# EAGLE design H0FR71 (EAGLE 9.6.2)

## Sheet 1 of 2
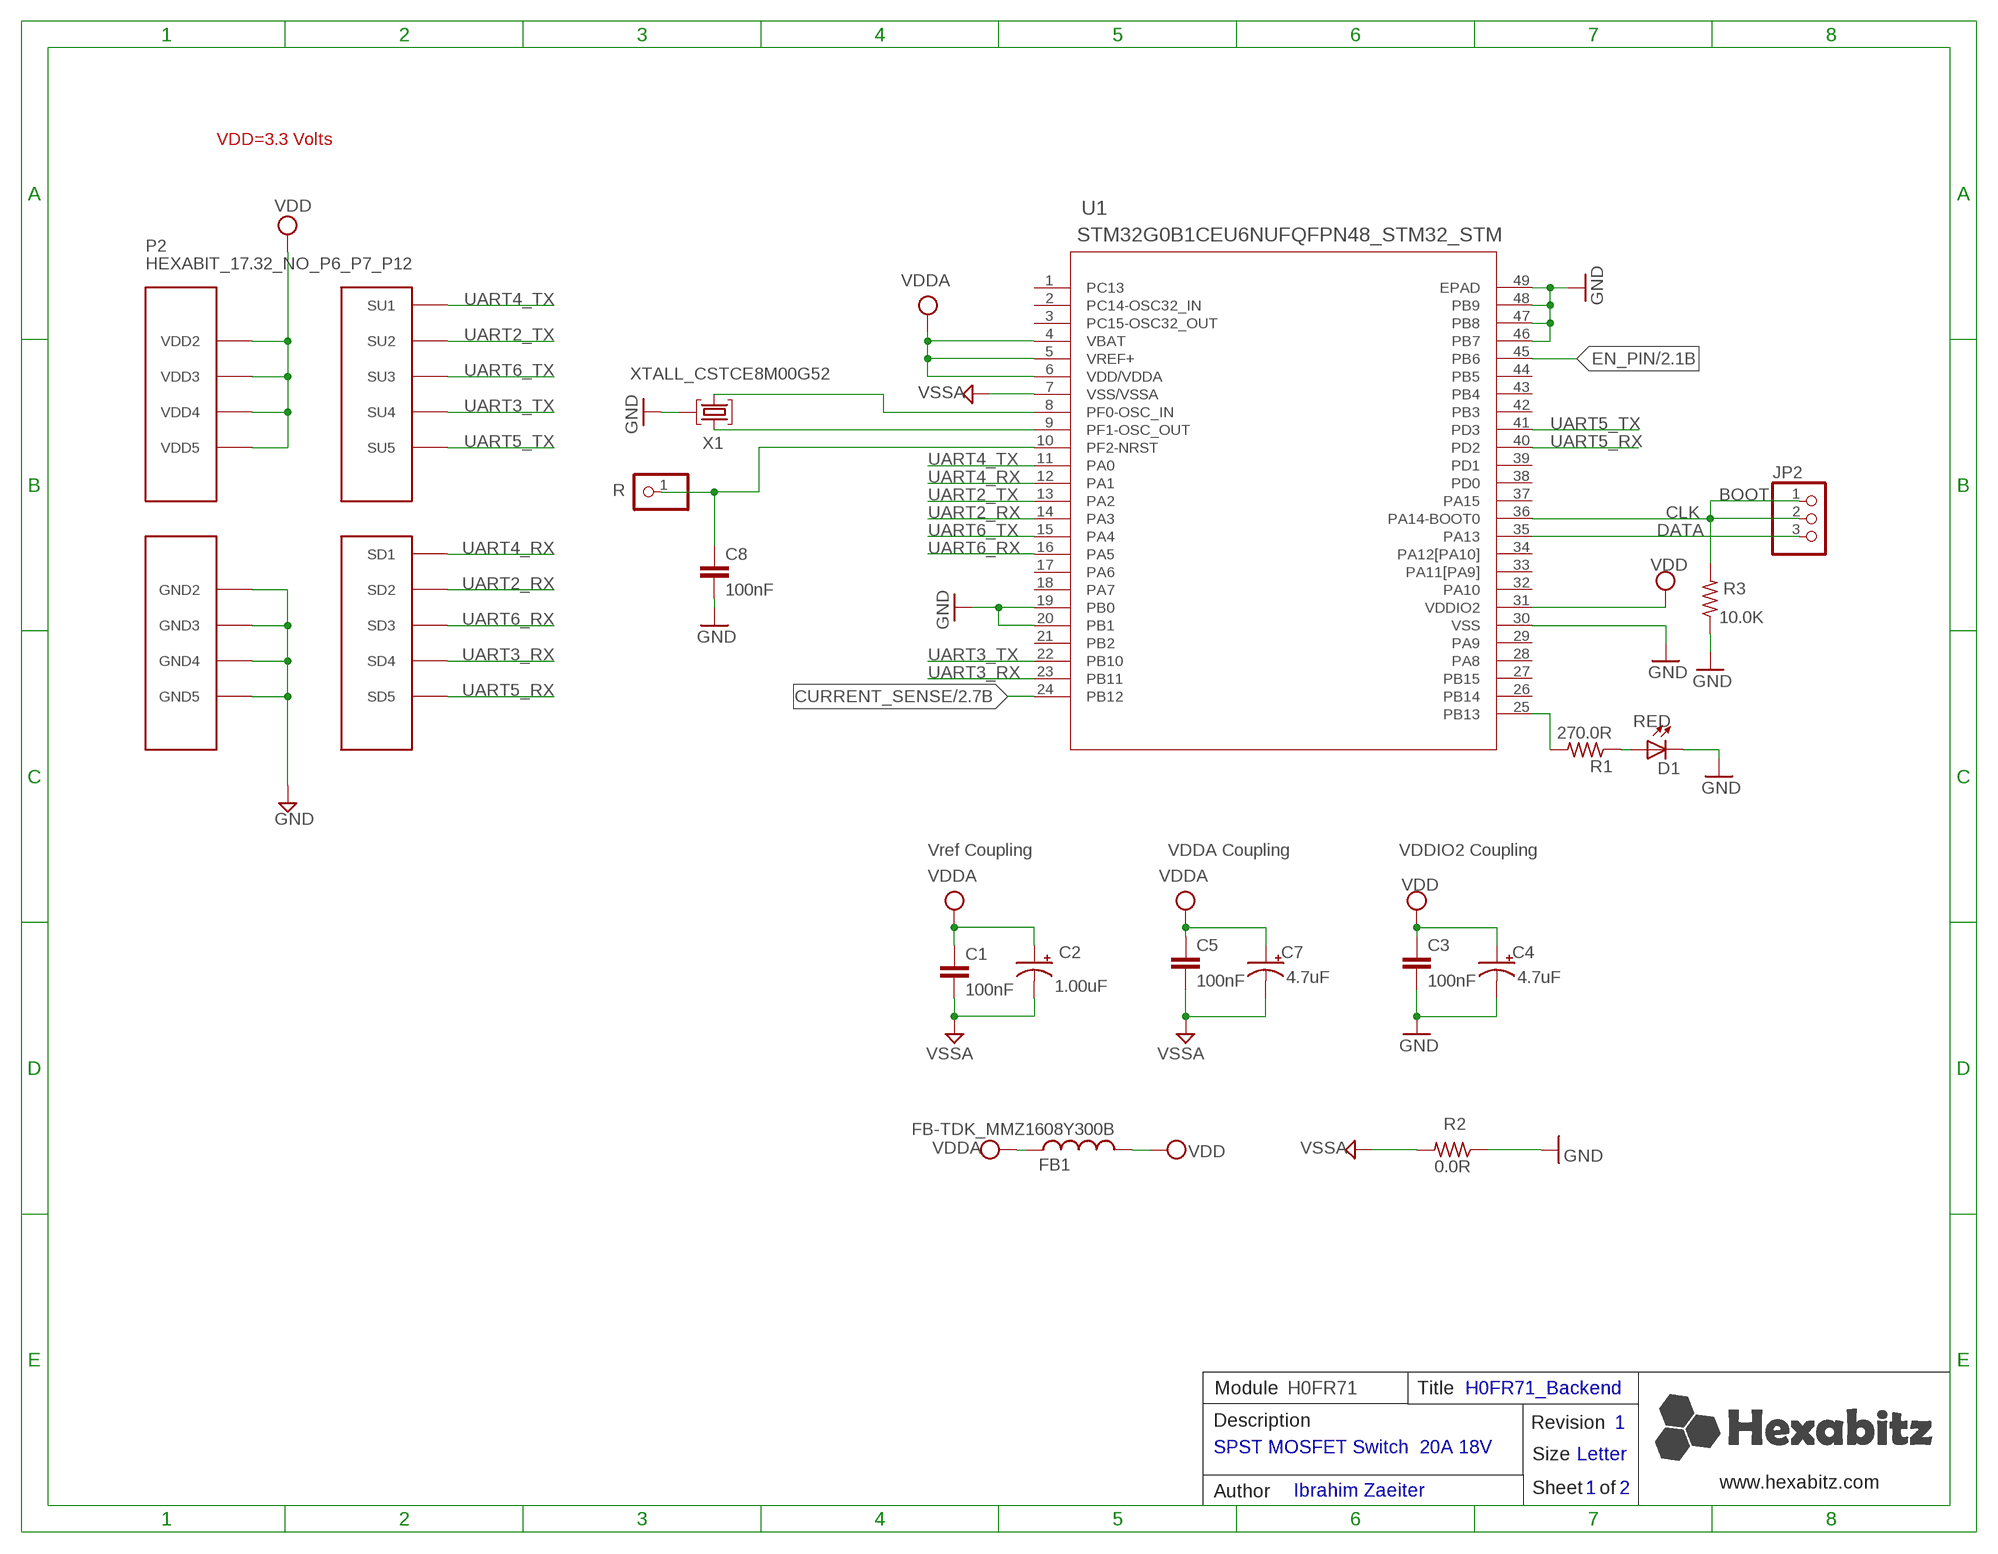
[diagram p0: schematic, sheet 1]

### Parts
C1  100nF  C-0603  [C-0603]
C2  1.00uF  C-0805-POL  [C-0805-POL]
C3  100nF  C-0603  [C-0603]
C4  4.7uF  C-0805-POL  [C-0805-POL]
C5  100nF  C-0603  [C-0603]
C7  4.7uF  C-0805-POL  [C-0805-POL]
C8  100nF  C-0603  [C-0603]
D1  RED  VLMS1300-GS08  [VLMS1300-GS08]
FB1  FB-TDK_MMZ1608Y300B  [FB-TDK_MMZ1608Y300B]
JP2  PINHD-1X3  [1X03]
P2  HEXABIT_17.32_NO_P6_P7_P12  [HEXABIT_17.32_NO_P6_P7_P12]
R  PINHD-1X1  [1X01]
R1  270.0R  R-0603  [R-0603]
R2  0.0R  R-0603  [R-0603]
R3  10.0K  R-0603  [R-0603]
U1  STM32G0B1CEU6NUFQFPN48_STM32_STM  [UFQFPN48_STM32_STM]
X1  XTALL_CSTCE8M00G52  [XTALL_CSTCE8M00G52]

### Nets
AGND: C1.2 C2.2(-) C5.2 C7.2(-) R2.2 U1.7(VSS/VSSA) ; supply symbol labelled VSSA ; also sheet 2
CLK: JP2.1 JP2.2 R3.2 U1.36(PA14-BOOT0)
CURRENT_SENSE: U1.24(PB12) ; also sheet 2
DATA: JP2.3 U1.35(PA13)
EN_PIN: U1.45(PB6) ; also sheet 2
GND: C3.2 C4.2(-) C8.2 D1.C P2.PAD_PD8(GND2) P2.PAD_PD9(GND3) P2.PAD_PD10(GND4) P2.PAD_PD11(GND5) R2.1 R3.1 U1.19(PB0) U1.20(PB1) U1.30(VSS) U1.46(PB7) U1.47(PB8) U1.48(PB9) U1.49(EPAD) X1.P$2 ; also sheet 2
N$1: U1.9(PF1-OSC_OUT) X1.P$3
N$2: U1.8(PF0-OSC_IN) X1.P$1
N$3: R1.2 U1.25(PB13)
N$4: D1.A R1.1
N$5: C8.1 R.1 U1.10(PF2-NRST)
UART2_RX: P2.PAD_PD2(SD2) U1.14(PA3)
UART2_TX: P2.PAD_PU2(SU2) U1.13(PA2)
UART3_RX: P2.PAD_PD4(SD4) U1.23(PB11)
UART3_TX: P2.PAD_PU4(SU4) U1.22(PB10)
UART4_RX: P2.PAD_PD1(SD1) U1.12(PA1)
UART4_TX: P2.PAD_PU1(SU1) U1.11(PA0)
UART5_RX: P2.PAD_PD5(SD5) U1.40(PD2)
UART5_TX: P2.PAD_PU5(SU5) U1.41(PD3)
UART6_RX: P2.PAD_PD3(SD3) U1.16(PA5)
UART6_TX: P2.PAD_PU3(SU3) U1.15(PA4)
VDD: C3.1 C4.1(+) FB1.2 P2.PAD_PU8(VDD2) P2.PAD_PU9(VDD3) P2.PAD_PU10(VDD4) P2.PAD_PU11(VDD5) U1.31(VDDIO2)
VDDA: C1.1 C2.1(+) C5.1 C7.1(+) FB1.1 U1.4(VBAT) U1.5(VREF+) U1.6(VDD/VDDA) ; also sheet 2
Unconnected: U1.1(PC13) U1.2(PC14-OSC32_IN) U1.3(PC15-OSC32_OUT) U1.17(PA6) U1.18(PA7) U1.21(PB2) U1.26(PB14) U1.27(PB15) U1.28(PA8) U1.29(PA9) U1.32(PA10) U1.33(PA11[PA9]) U1.34(PA12[PA10]) U1.37(PA15) U1.38(PD0) U1.39(PD1) U1.42(PB3) U1.43(PB4) U1.44(PB5)

### Notes on the sheet
- VDD=3.3 Volts
- BOOT
- Vref Coupling | VDDA Coupling | VDDIO2 Coupling
- Module | H0FR71 | Title | H0FR71_Backend
- Description | Revision | 1
- SPST MOSFET Switch  20A 18V
- Size | Letter
- www.hexabitz.com
- Author | Ibrahim Zaeiter | Sheet   of | 1 | 2
- C:/Users/Admin/Desktop/logodraft.bmp

## Sheet 2 of 2
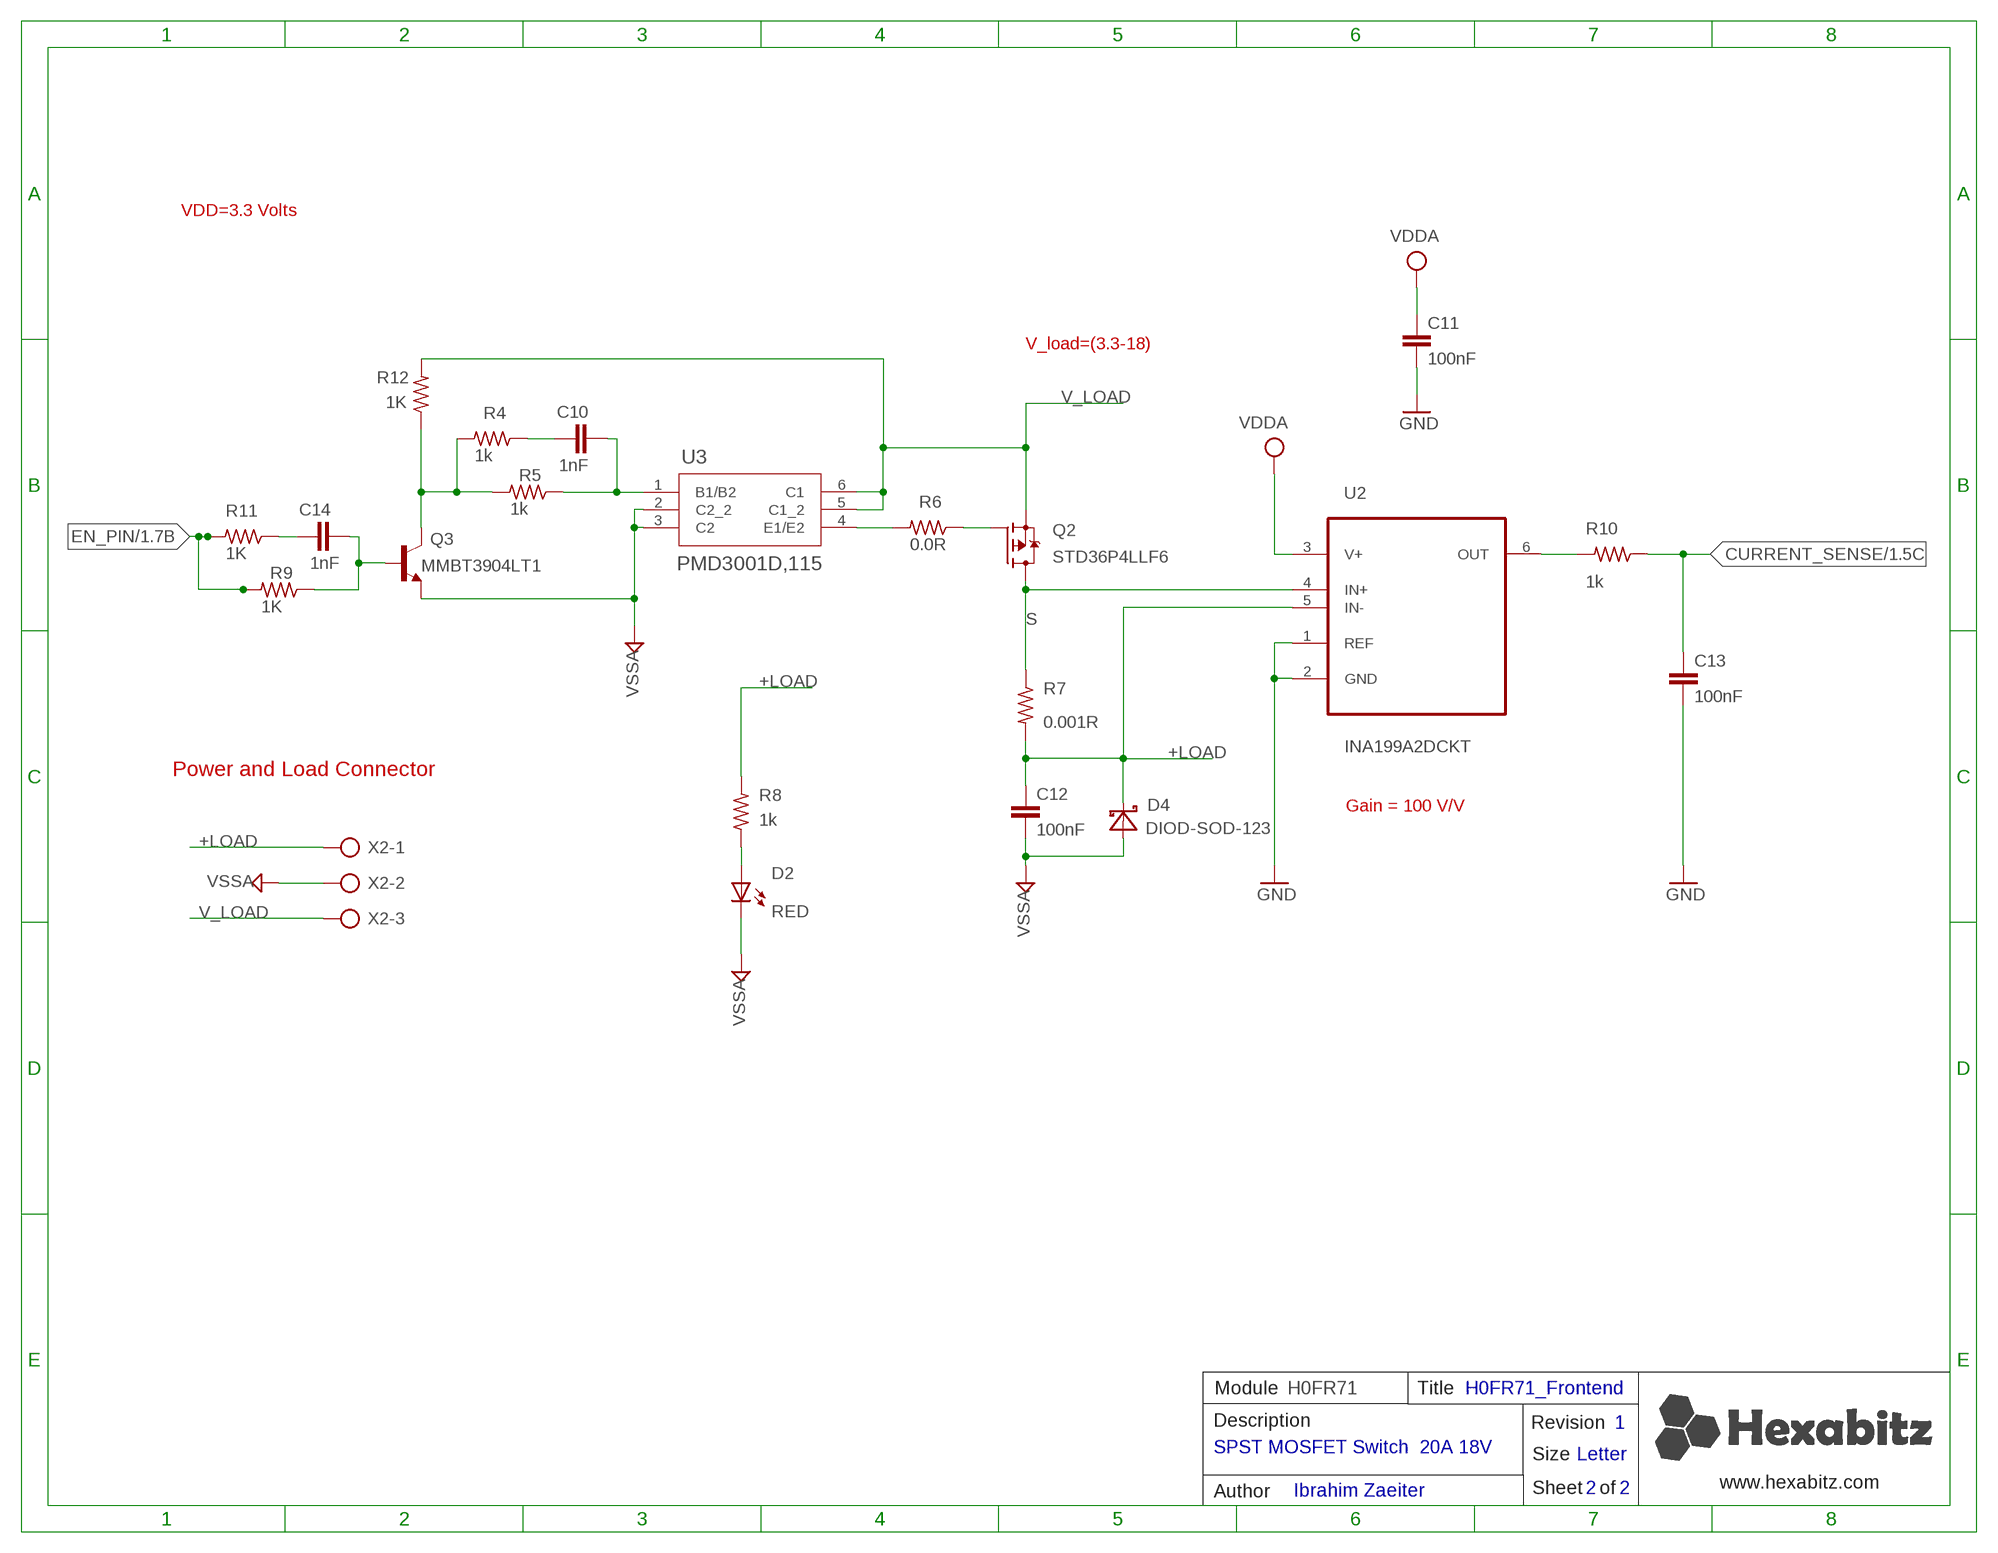
[diagram p1: schematic, sheet 2]

### Parts
C10  1nF  C-0603  [C-0603]
C11  100nF  C-0603  [C-0603]
C12  100nF  C-0603  [C-0603]
C13  100nF  C-0603  [C-0603]
C14  1nF  C-0603  [C-0603]
D2  RED  VLMS1300-GS08  [VLMS1300-GS08]
D4  DIOD-SOD-123  [SOD123]
Q2  STD36P4LLF6  [DPAK-3]
Q3  MMBT3904LT1  [MMBT3904LT1]
R4  1k  R-0603  [R-0603]
R5  1k  R-0603  [R-0603]
R6  0.0R  R-0603  [R-0603]
R7  0.001R  R-US_R2512  [R2512]
R8  1k  R-0603  [R-0603]
R9  1K  R-0603  [R-0603]
R10  1k  R-0603  [R-0603]
R11  1K  R-0603  [R-0603]
R12  1K  R-0603  [R-0603]
U2  INA199A2DCKT  [SOT65P210X110-6N]
U3  PMD3001D,115  PMD3001DSOT457_NEX  [SOT457_NEX]
X2  AK500/3  [AK500/3]

### Nets
+LOAD: C12.1 D4.2(C) R7.2 R8.2 U2.5(IN-) X2.1
AGND: C12.2 D2.C D4.1(A) Q3.2(E) U3.2(C2_2) U3.3(C2) X2.2 ; supply symbol labelled VSSA ; also sheet 1
CURRENT_SENSE: C13.1 R10.1 ; also sheet 1
EN_PIN: R9.2 R11.2 ; also sheet 1
GND: C11.2 C13.2 U2.1(REF) U2.2(GND) ; also sheet 1
N$7: C10.2 R5.1 U3.1(B1/B2)
N$8: D2.A R8.1
N$9: R10.2 U2.6(OUT)
N$10: Q2.1(G) R6.1
N$11: Q3.3(C) R4.2 R5.2 R12.1
N$12: R6.2 U3.4(E1/E2)
N$13: C10.1 R4.1
N$14: C14.2 Q3.1(B) R9.1
N$15: C14.1 R11.1
S: Q2.4(D) R7.1 U2.4(IN+)
V_LOAD: Q2.3(S) R12.2 U3.5(C1_2) U3.6(C1) X2.3
VDDA: C11.1 U2.3(V+) ; also sheet 1

### Notes on the sheet
- VDD=3.3 Volts
- V_load=(3.3-18)
- Power and Load Connector
- Gain = 100 V/V
- Module | H0FR71 | Title | H0FR71_Frontend
- Description | Revision | 1
- SPST MOSFET Switch  20A 18V
- Size | Letter
- www.hexabitz.com
- Author | Ibrahim Zaeiter | Sheet   of | 2 | 2

## Library data of the parts
C1 C3 C8 C10 C12-C14 = HEXABITZ_RCLS:C-0603: CAP CER 10% X7R 0603; CAPACITANCE: 100nF; MFN: KEMET; MPN: C0603C104K8RACTU; OCTOPART_URL: https://octopart.com/c0603c104k8ractu-kemet-145075?r=sp&s=9bS9ASSwSEqMCE9KBEQZ0g; TOLERANCE: 10%; VOLTAGE_RATING: 10V
C2 = HEXABITZ_RCLS:C-0805-POL: Cap Tant Solid SMD 2012; CAPACITANCE: 1.00uF; MFN: Yageo; MPN: CC0805KKX7R7BB105; OCTOPART_URL: https://octopart.com/cc0805kkx7r7bb105-yageo-8376555?r=sp&s=YKl1wwtkROau_X5nniH2ig; TOLERANCE: 10%; VOLTAGE_RATING: 16V
C4 C7 = HEXABITZ_RCLS:C-0805-POL: Cap Tant Solid SMD 2012; CAPACITANCE: 4.7uF; MFN: Murata; MPN: GRM21BC81E475KA12L; OCTOPART_URL: https://octopart.com/grm21bc81e475ka12l-murata-10331911?r=sp&s=RY3qZSD8T6mG6TC9CHI5qQ; TOLERANCE: 10%; VOLTAGE_RATING: 25V
C5 = HEXABITZ_RCLS:C-0603: CAP CER 10% X7R 0603; CAPACITANCE: 100nF; MFN: KEMET; MPN: C0603C104K8RACTU; OCTOPART_URL: https://octopart.com/c0603c104k8ractu-kemet-145075?r=sp&s=9bS9ASSwSEqMCE9KBEQZ0g; TOLERANCE: 10%; VOLTAGE_RATING: 10
C11 = HEXABITZ_RCLS:C-0603: CAP CER 10% X7R 0603; CAPACITANCE: 100nF; MFN: KEMET; MPN: C0603C104K8RACTU; OCTOPART_URL: https://octopart.com/c0603c104k8ractu-kemet-145075?r=sp&s=9bS9ASSwSEqMCE9KBEQZ0g; TOLERANCE: 10V; VOLTAGE_RATING: 10%
D1 = HEXABITZ_USER_INTERFACE_PARTS:VLMS1300-GS08: Red 0603 130° Clear 54 mcd 2 V Surface Mount ChipLED ; Octopart Url : http://octopart.com/vlms1300-gs08-vishay-21709201; MFN: Vishay; MPN: VLMS1300-GS08; OCTOPART_URL: https://octopart.com/vlms1300-gs08-vishay-21709201?r=sp&s=_gcP4_q8T1SC6PJQPTQ9yA
D2 = HEXABITZ_USER_INTERFACE_PARTS:VLMS1300-GS08: Red 0603 130° Clear 54 mcd 2 V Surface Mount ChipLED ; Octopart Url : http://octopart.com/vlms1300-gs08-vishay-21709201; MFN: Vishay; MPN: VLMO1300-GS08; OCTOPART_URL: https://octopart.com/vlmo1300-gs08-vishay-21709200?r=sp#
D4 = HEXABITZ_RCLS:DIOD-SOD-123: 1.0 A Surface Mount Schottky Barrier Rectifier, 40 V, -65 to 125 degC, 2-Pin SOD-123 Package, RoHS, Tape and Reel
FB1 = HEXABITZ_RCLS:FB-TDK_MMZ1608Y300B: Ferrite Beads Multi-Layer 30Ohm 25% 100MHz 1.5A 50mOhm DCR 0603; MFN: TDK; MPN: MMZ1608Y300B; OCTOPART_URL: https://octopart.com/mmz1608y300b-tdk-368280?r=sp&s=cd9_2ZEqQ9q9UNBuQgHAiA
JP2 = pinhead:PINHD-1X3: PIN HEADER
P2 = hexabitz_connectors:HEXABIT_?_NO_P6_P7_P12: Hexabitz Hexagon Module Connector Hexagon side length = 17.32mm. The following ports are removed: P6 P7 P12
Q2 = HEXABITZ_RCLS:STD36P4LLF6: P-channel 40 V, 0.0175 Ω typ.,36 A, STripFET™ F6 Power MOSFET in a DPAK package; DISCRIPTION: P-channel 40 V, 0.0175 Ohm typ., 36 A STripFET F6 in a DPAK package; MFN: STMicroelectronics; MPN: STD36P4LLF6; OCTOPART_URL: https://octopart.com/std36p4llf6-stmicroelectronics-34425371?r=sp
Q3 = HEXABITZ_RCLS:MMBT3904LT1: TRANS NPN 40V 0.2A SOT23; MOUNTING_STYLE: Surface Mount; NUM_OF_PINS: 3; PACKAGE: SOT-23-3; PACKAGING: Reel; PRODUCT_CATEGORY: Transistors Bipolar-BJT; SERIES: MMBT3904L
R = HEXABITZ_USER_INTERFACE_PARTS:PINHD-1X1: PIN HEADER; MFN: TE Connectivity; MPN: 87227-1; OCTOPART_URL: https://octopart.com/87227-1-te+connectivity-39512052?r=sp
R1 = HEXABITZ_RCLS:R-0603: Thick Film Resistors - SMD 0603; MFN: Yageo; MPN: RC0603FR-07270RL; OCTOPART_URL: https://octopart.com/search?q=RC0603FR-07270RL&start=0; RESISTANCE: 270.0 Ohm; TOLERANCE: 1%
R2 R6 = HEXABITZ_RCLS:R-0603: Thick Film Resistors - SMD 0603; MFN: Yageo; MPN: RC0603JR-070RL; OCTOPART_URL: https://octopart.com/rc0603jr-070rl-yageo-1241539?r=sp&s=X2NteqRjRNWrnx42Y0aliA; RESISTANCE: 0.0 Ohm
R3 R12 = HEXABITZ_RCLS:R-0603: Thick Film Resistors - SMD 0603; MFN: Yageo; MPN: RC0603JR-0710KL; OCTOPART_URL: https://octopart.com/search?q=RC0603JR-0710KL&start=0; RESISTANCE: 10.0K Ohm; TOLERANCE: 5%
R4 R5 R9 R11 = HEXABITZ_RCLS:R-0603: Thick Film Resistors - SMD 0603; MFN: Yageo; MPN: RC0603JR-07680KL; OCTOPART_URL: https://octopart.com/rc0603jr-07680kl-yageo-40953169?r=sp; RESISTANCE: 680K Ohm; TOLERANCE: 5%
R7 = HEXABITZ_RCLS:R-US_: RESISTOR, American symbol; SPICEPREFIX: R
R8 = HEXABITZ_RCLS:R-0603: Thick Film Resistors - SMD 0603; MFN: Yageo; MPN: RC0603JR-071KL; OCTOPART_URL: https://octopart.com/rc0603jr-071kl-yageo-55402888?r=sp; RESISTANCE: 1k; TOLERANCE: 1%
R10 = HEXABITZ_RCLS:R-0603: Thick Film Resistors - SMD 0603; MFN: Yageo; MPN: RC0603JR-071KL; OCTOPART_URL: https://octopart.com/rc0603jr-071kl-yageo-55402888?r=sp; RESISTANCE: 1k; TOLERANCE: 5%
U1 = HEXABITZ_ICs:STM32G0B1CEU6N; COPYRIGHT: Copyright (C) 2022 Ultra Librarian. All rights reserved.; MFN: STMicroelectronics; MPN: STM32G0B1CEU6N; OCTOPART_URL: https://app.ultralibrarian.com/details/c038d58b-752a-11eb-9033-0a34d6323d74/STMicroelectronics/STM32G0B1CEU6N?uid=116364672
U2 = HEXABITZ_ICs:INA199A2DCKT: CURRENT SHUNT MONITOR; DESCRIPTION: 26V, bi-directional current sense amplifier 6-SC70 -40 to 125; MFN: Texas Instruments; MPN: INA199A2DCKT; OCTOPART_URL: https://octopart.com/ina199a2dckt-texas+instruments-18607270?r=sp
U3 = PMD3001D,115:PMD3001D; COPYRIGHT: Copyright (C) 2022 Ultra Librarian. All rights reserved.; MANUFACTURER_PART_NUMBER: PMD3001D; MFR_NAME: Nexperia
X1 = HEXABITZ_OTHER_PARTS:XTALL_CSTCE8M00G52: MURATA CSTCE8M00G52-R0 RESONATOR, SMD, 8MHZ ; Octopart Url : https://octopart.com/cstce8m00g52-r0-murata-7145559; MFN: Murata; MPN: CSTCE8M00G52Z-R0; OCTOPART_URL: https://octopart.com/cstce8m00g52z-r0-murata-17755941?r=sp&s=JDnNJnrHQhyS8Zk4ofFWXw
X2 = HEXABITZ_CONNECTION_PARTS:AK500/3: CONNECTOR; DESCRIPTION: Altech 34.403 PCB Terminal, Front wire, 3 Pole, 10.00mm AK500/03DS-10.0-V, 20A, 300V, grey; MFN: Altech; MPN: AK500/3; OCTOPART_URL: https://octopart.com/30.703-altech-46803?r=sp

## Board
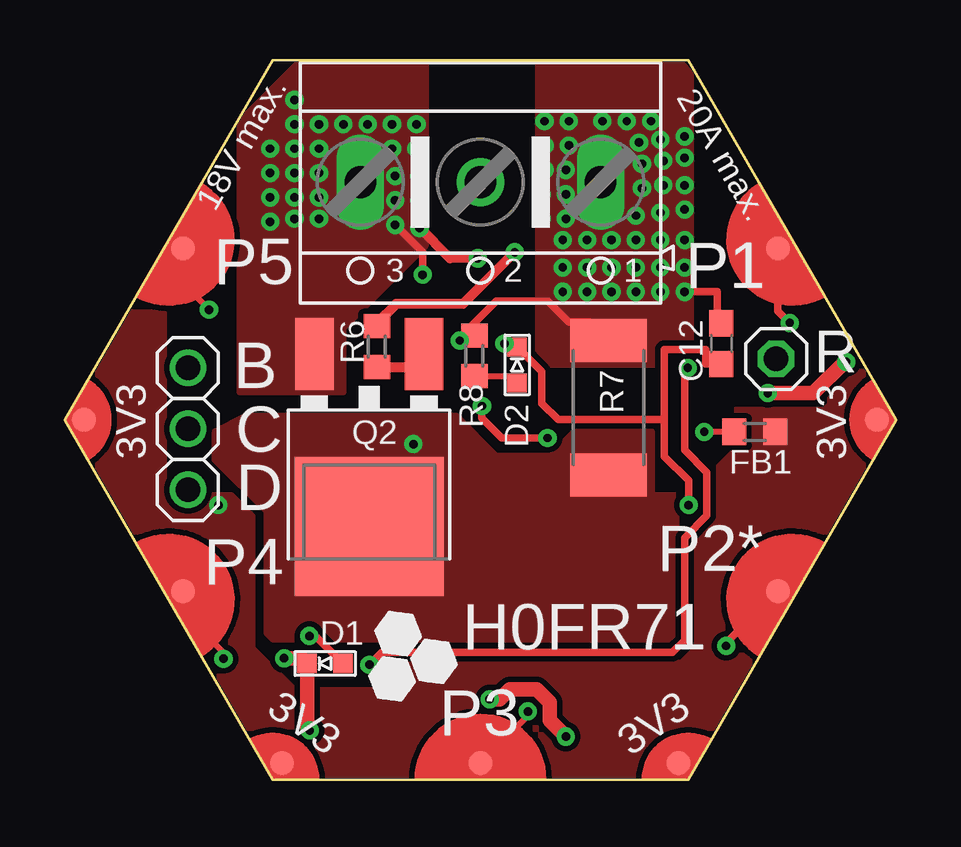
[diagram p2: board, top side]
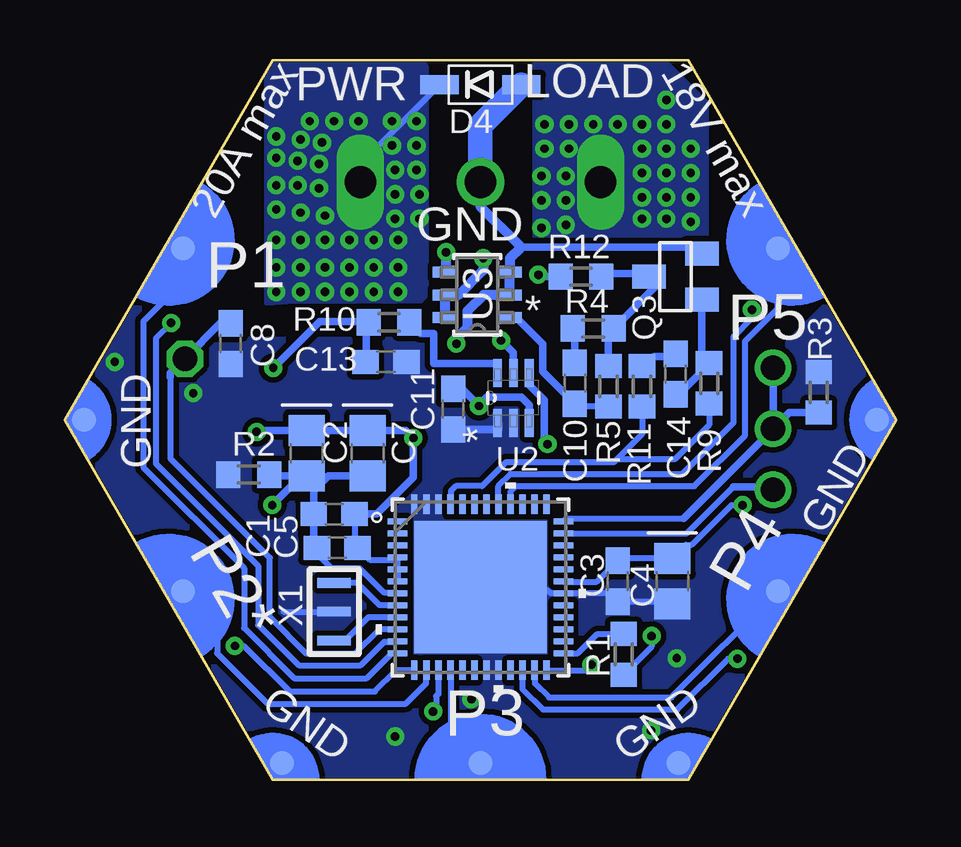
[diagram p3: board, bottom side, seen from below]

Size 34.64 x 30 mm. Coordinates in mm from the lower left corner, seen from the top.
Copper layers (1*16): Top 0.035mm / dielectric 1.5mm / Bottom 0.035mm
Design rules "2_layer *": minimum track width 7mil, minimum drill 10mil, track to track 9mil, track to pad 9mil, pad to pad 9mil, via to via 9mil, smd to smd 0mil, copper to edge 1mil, drill to drill 8mil, minimum pad ring 10mil, minimum via ring 8mil, stop-mask expansion 2mil, vias tented up to drill 15mil, thermal gap 10mil

### Footprints (pad centres in the part's own frame; a part is rotated, then mirrored left to right if it is on the bottom)
C-0603 = smd 1.1 x 1: 1 -0.85,0; 2 0.85,0
C-0805-POL = smd 1.3 x 1.5: 1 -0.95,0; 2 0.95,0
VLMS1300-GS08 = smd 0.8 x 0.8: A 0,0.75; C 0,-0.75
SOD123 = smd 1.6 x 0.8: 1 -1.7,0; 2 1.7,0
FB-TDK_MMZ1608Y300B = smd 1 x 1.1: 1 -0.85,0; 2 0.85,0
1X03 = drill 1.016: 1 -2.54,0; 2 0,0; 3 2.54,0
HEXABIT_17.32_NO_P6_P7_P12 = smd 1 x 1 bottom: PAD_PD1 12.39,7.15; PAD_PD2 12.39,-7.15; PAD_PD3 0,-14.31; PAD_PD4 -12.39,-7.15; PAD_PD5 -12.39,7.15; PAD_PD8 16.52,0; PAD_PD9 8.26,-14.31; PAD_PD10 -8.26,-14.31; PAD_PD11 -16.52,0 | smd 1 x 1: PAD_PU1 12.39,7.15; PAD_PU2 12.39,-7.15; PAD_PU3 0,-14.31; PAD_PU4 -12.39,-7.15; PAD_PU5 -12.39,7.15; PAD_PU8 16.52,0; PAD_PU9 8.26,-14.31; PAD_PU10 -8.26,-14.31; PAD_PU11 -16.52,0
DPAK-3 = smd 1.6 x 3: 1 -2.286,-7.18; 3 2.286,-7.18 | smd 6.2 x 5.8: 4 0,0
MMBT3904LT1 = smd 1 x 1.4: 1 -0.95,-1.1; 2 0.95,-1.1; 3 0,1.1
1X01 = drill 1.016 octagon: 1 0,0
R-0603 = smd 1 x 1.1: 1 -0.85,0; 2 0.85,0
R2512 = smd 1.8 x 3.2: 1 -2.8,0; 2 2.8,0
UFQFPN48_STM32_STM = smd 0.813 x 0.254: 1 -3.454,2.751; 2 -3.454,2.251; 3 -3.454,1.75; 4 -3.454,1.25; 5 -3.454,0.75; 6 -3.454,0.25; 7 -3.454,-0.25; 8 -3.454,-0.75; 9 -3.454,-1.25; 10 -3.454,-1.75; 11 -3.454,-2.251; 12 -3.454,-2.751; 25 3.454,-2.751; 26 3.454,-2.251; 27 3.454,-1.75; 28 3.454,-1.25; 29 3.454,-0.75; 30 3.454,-0.25; 31 3.454,0.25; 32 3.454,0.75; 33 3.454,1.25; 34 3.454,1.75; 35 3.454,2.251; 36 3.454,2.751 | smd 0.254 x 0.813: 13 -2.751,-3.454; 14 -2.251,-3.454; 15 -1.75,-3.454; 16 -1.25,-3.454; 17 -0.75,-3.454; 18 -0.25,-3.454; 19 0.25,-3.454; 20 0.75,-3.454; 21 1.25,-3.454; 22 1.75,-3.454; 23 2.251,-3.454; 24 2.751,-3.454; 37 2.751,3.454; 38 2.251,3.454; 39 1.75,3.454; 40 1.25,3.454; 41 0.75,3.454; 42 0.25,3.454; 43 -0.25,3.454; 44 -0.75,3.454; 45 -1.25,3.454; 46 -1.75,3.454; 47 -2.251,3.454; 48 -2.751,3.454 | smd 5.512 x 5.512: 49 0,0
SOT65P210X110-6N = smd 1.168 x 0.356: 1 -1.041,0.66; 2 -1.041,0; 3 -1.041,-0.66; 4 1.041,-0.66; 5 1.041,0; 6 1.041,0.66
SOT457_NEX = smd 1.003 x 0.457: 1 -1.353,0.95; 2 -1.353,0; 3 -1.353,-0.95; 4 1.353,-0.95; 5 1.353,0; 6 1.353,0.95
XTALL_CSTCE8M00G52 = smd 1.4 x 0.4: P$1 0,1.2; P$2 0,0; P$3 0,-1.2
AK500/3 = drill 1.321 long: 1 -5.004,0; 3 5.004,0 | drill 1.321: 2 0,0

### Placement (x,y rotation side)
C1  23.29,9.67 180 bottom
C2  24.56,13.6 270 bottom
C3  11.61,8.27 270 bottom
C4  9.32,8.27 270 bottom
C5  23.42,11.06 180 bottom
C7  22.02,13.6 270 bottom
C8  27.73,18.17 270 bottom
C10  13.38,16.52 270 bottom
C11  18.46,15.44 270 bottom
C12  27.35,18.17 270 top
C13  21.26,17.41 0 bottom
C14  9.19,16.91 270 bottom
D1  10.84,4.84 270 top
D2  18.84,17.29 180 top
D4  17.32,28.97 180 bottom
FB1  28.75,14.49 0 top
JP2  5.13,14.62 270 top
P2  17.32,15 0 top
Q2  12.68,10.55 180 top
Q3  9.19,20.97 90 bottom
R  29.64,17.54 0 top
R1  11.35,5.22 90 bottom
R2  26.97,12.71 0 bottom
R3  3.22,16.14 270 bottom
R4  12.62,18.81 0 bottom
R5  11.99,16.4 90 bottom
R6  13,18.05 90 top
R7  22.65,15.5 90 top
R8  17.07,17.67 90 top
R9  7.8,16.52 270 bottom
R10  21.13,19.06 0 bottom
R11  10.59,16.4 270 bottom
R12  13.13,20.97 180 bottom
U1  17.32,8.02 0 bottom
U2  15.95,15.91 90 bottom
U3  17.45,20.21 180 bottom
X1  23.42,7 0 bottom
X2  17.32,24.91 180 top

### Tracks (layer width: path | path; a pad name or v marks a point on that pad's centre or on a via)
+LOAD  (via drill 0.35)
  Top 0.305: R7.2 21.89,19.06 21,19.06 20.11,19.95 17.98,19.95 16.46,18.43 v16.46,18.3 16.67,18.52 R8.2 | C12.1 27.18,19.02 27.18,20.33 v25.83,20.33
  Bottom 0.254: D4.2 22.32,25.67 X2.1
  Bottom 0.305: U2.5 15.95,17.79 v16.46,18.3
  other vias: 24.81,26.68 23.42,27.45 22.4,27.45 24.43,27.45 25.83,26.81 24.94,24.78 21,27.45 19.99,27.45 25.83,24.78 24.05,24.65 23.8,22.49 23.92,26.56 24.81,23.64 24.94,25.8 23.8,23.51 24.81,22.49 20.88,24.4 19.86,24.4 19.99,25.41 20.88,25.41 25.83,23.76 19.99,26.43 21,26.43 22.78,21.35 24.05,25.67 25.83,25.92 24.81,21.35 23.8,21.35 21.77,21.35 22.78,20.33 25.83,21.35 25.83,22.49 19.86,23.38 20.88,23.38 20.75,22.49 23.8,20.33 21.77,22.49 20.75,21.35 24.81,20.33 22.78,22.49 20.75,20.33 21.77,20.33
  pour Top (no thermals): 19.73,17.41 19.73,29.86 25.7,29.86 26.08,29.48 26.08,17.29 19.86,17.29
  pour Bottom (no thermals): 19.61,29.73 19.61,20.21 19.86,19.95 25.07,19.95 26.21,19.87 26.21,29.86 26.08,29.99 19.86,29.99
AGND  (via drill 0.35)
  Top 0.305: 24.98,15 20.56,15 19.88,15.69 19.88,17 D2.C 18.7,18.17 v18.32,18.17 | v25.99,11.44 25.99,12.46 24.98,13.48 24.98,15 | C12.2 26.72,17.33 26.72,17.92 24.98,17.92 24.98,15
  Bottom 0.178: C2.2 24.53,12.62
  Bottom 0.254: 15.62,22.19 15.67,22.24 15.67,22.16 | Q3.2 7.82,22.19 | U1.7 20.79,7.78 21.33,7.78 22.36,8.81 23.52,8.81 24.14,9.43 C1.2
  Bottom 0.305: 17.32,23.89 X2.2 17.4,24.98 | 7.82,22.19 15.62,22.19 | C1.2 24.27,9.79 C5.2 24.27,12.04 23.76,12.55 | 23.76,12.55 23.83,12.62 24.53,12.62 | C7.2 23.65,12.65 23.76,12.55 | 24.79,12.65 C2.2 | v25.99,11.44 24.79,12.65 | R2.2 26.06,12.65 24.79,12.65
  Bottom 0.406: 15.67,22.24 17.32,23.89 | 15.67,22.16 16.09,21.73 U3.3 U3.2 17.19,20.21 17.87,19.53 17.87,18.85 18.32,18.39 v18.32,18.17
  Bottom 1.016: D4.1 17.32,27.27 X2.2
CLK
  Bottom 0.254: U1.36 13.74,10.89 8.85,10.89
  Bottom 0.305: 8.85,10.89 JP2.2 | JP2.2 4.45,15.29 R3.2 | JP2.1 JP2.2
CURRENT_SENSE  (via drill 0.35)
  Top 0.305: v12.7,4.79 13.21,5.29 25.32,5.29 25.83,5.8 25.83,10.08 26.75,11 26.75,12.8 25.83,13.73 25.83,17.03 v25.96,17.16
  Bottom 0.254: U1.24 12.92,4.56 v12.7,4.79
  Bottom 0.305: v25.96,17.16 24.01,19.1 22.02,19.1 R10.1 22.07,19.15 C13.1
DATA
  Bottom 0.254: 6.78,12.21 8.72,10.27 U1.35 | 5.26,12.21 JP2.3
  Bottom 0.305: 6.78,12.21 5.26,12.21
EN_PIN
  Bottom 0.254: R9.2 7.8,14.79 9.23,13.35 11.64,13.35 | R11.2 10.59,14.4 11.64,13.35 | 11.64,13.35 11.77,13.23 16.26,13.23 17.25,12.23 18.34,12.23 18.55,12.02 18.55,11.49 U1.45
GND  (via drill 0.35)
  Top 0.61: v20.88,1.79 20.2,2.46 20.2,3.22 19.67,3.75 18.54,3.75 18.13,3.35 v17.7,3.35 | v32.56,17.41 32.49,17.41 31.19,16.11 v29.29,16.11 | v9.14,5.06 9.87,5.06 D1.C 10.09,2.16 v10.21,2.05
  Bottom 0.254: 25.54,7 X1.P$2 | C4.2 9.42,7.42 C3.2 11.95,7.77 U1.30 14.4,7.77 14.53,7.89 16.05,7.89
  Bottom 0.305: C11.2 16.56,14.59 16.56,14.82 U2.1
  pour Bottom (no thermals): 2.71,19.95 0.05,15 8.56,0.14 25.96,0.14 34.59,15 31.29,20.59 29,18.3 6.78,18.3 5.76,17.29 5.38,17.29
N$1
  Bottom 0.254: U1.9 21.99,6.77 22.96,5.8 X1.P$3
N$2
  Bottom 0.254: U1.8 21.52,7.27 22.46,8.2 X1.P$1
N$3
  Bottom 0.254: U1.25 13.26,5.26 12.45,6.07 R1.2
N$4  (via drill 0.35)
  Top 0.305: D1.A 10.44,5.98 v10.19,5.98
  Bottom 0.254: R1.1 10.19,5.53 v10.19,5.98
N$5
  Bottom 0.254: 30.24,16.78 30.24,13.38 26.1,9.24 26.1,6.77 24.57,5.24 22.57,5.24 21.55,6.27 U1.10
  Bottom 0.305: C8.1 28.15,19.02 R.1 30.24,16.94 30.24,16.78
N$7
  Bottom 0.178: C10.2 13.49,15.78
  Bottom 0.254: R5.1 13.26,15.55
  Bottom 0.305: C10.2 13.26,15.55 | 13.49,15.78 14.73,17.02 14.73,18.16 15.83,19.26 U3.1
N$8
  Top 0.254: D2.A 19.12,16.82 R8.1
N$9
  Bottom 0.305: U2.6 16.61,17.34 19.26,17.34 19.26,18.59 19.8,18.59 R10.2
N$10
  Top 0.305: 14.87,17.2 14.91,17.16 14.97,17.22 Q2.1
  Top 0.406: R6.1 14.87,17.2
N$11
  Bottom 0.254: R12.1 12.5,21.1 | 10.42,21.1 Q3.3
  Bottom 0.305: 12.5,21.1 10.42,21.1 | Q3.3 9.95,20.63 R4.2 11.69,18.73 11.99,18.43 R5.2
N$12  (via drill 0.35)
  Top 0.406: R6.2 13,19.02 13.8,19.83 16.59,19.83 v18.75,21.98
  Bottom 0.406: U3.4 18.75,21.21 v18.75,21.98
N$13
  Bottom 0.305: R4.1 13.38,18.72 C10.1
N$14
  Bottom 0.305: Q3.1 8.09,17.67 R9.1 7.8,17.33 9.07,16.05 C14.2
N$15
  Bottom 0.254: R11.1 10.46,17.25 | 9.32,17.63 C14.1
  Bottom 0.305: 10.46,17.25 10.08,17.63 9.32,17.63
S  (via drill 0.35)
  Bottom 0.305: U2.4 15.29,16.45 14.65,15.81 14.65,14.11 v14.53,13.98
  pour Top (no thermals): 6.27,14.49 7.54,15.13 16.3,15.13 17.95,13.48 20.24,13.48 21.26,14.49 24.43,14.49 24.43,11.95 24.56,11.82 25.45,11.82 25.45,6.11 25.19,5.86 8.68,5.86 8.43,6.11 8.43,11.19 6.27,13.35
UART2_RX
  Bottom 0.254: P2.PAD_PD2 28.29,6.43 28.29,5.27 26.18,3.16 20.43,3.16 19.59,4.01 19.59,4.54 U1.14
UART2_TX  (via drill 0.35)
  Top 0.254: 27.55,5.69 v27.55,5.57
  Top 0.305: P2.PAD_PU2 27.55,5.69
  Bottom 0.254: v27.55,5.57 27.17,5.57 25.27,3.67 21.72,3.67 20.83,4.56 U1.13
UART3_RX
  Bottom 0.254: U1.23 15.05,4.54 15.05,4.01 14.46,3.42 9.36,3.42 P2.PAD_PD4
UART3_TX  (via drill 0.35)
  Top 0.254: v6.62,5.04 6.62,5.29 4.93,6.98 P2.PAD_PU4
  Bottom 0.254: U1.22 15.57,3.77 14.72,2.92 9.11,2.92 7,5.04 v6.62,5.04
UART4_RX
  Bottom 0.254: P2.PAD_PD1 29.71,20.75 31.36,19.1 31.36,13.01 27.17,8.82 27.17,6.32 25.08,4.23 22.06,4.23 21.02,5.26 U1.12
UART4_TX  (via drill 0.35)
  Top 0.305: v30.21,19.03 29.71,19.53 P2.PAD_PU1
  Bottom 0.254: U1.11 20.79,5.75 21.33,5.75 22.31,4.76 24.9,4.76 26.58,6.45 26.58,8.91 30.84,13.17 30.84,18.4 v30.21,19.03
UART5_RX
  Bottom 0.254: U1.40 16.05,11.49 16.05,12.02 15.84,12.23 8.41,12.23 6.29,14.35 6.29,18.27 4.93,19.63 P2.PAD_PD5
UART5_TX  (via drill 0.35)
  Top 0.254: v6.01,19.59 4.93,20.67 P2.PAD_PU5
  Bottom 0.254: U1.41 16.57,12.23 16.06,12.74 8.91,12.74 6.77,14.88 6.77,18.48 6.01,19.23 v6.01,19.59
UART6_RX
  Bottom 0.254: U1.16 18.55,4.54 18.55,1.85 17.4,0.69 P2.PAD_PD3
UART6_TX  (via drill 0.35)
  Top 0.254: v19.29,2.84 19.29,2.66 P2.PAD_PU3
  Bottom 0.254: U1.15 19.07,3.57 19.17,3.48 19.17,2.97 v19.29,2.84
V_LOAD  (via drill 0.35)
  Top 0.305: v13.76,23.13 14.91,21.98 v14.91,21.05
  Top 0.406: v17.2,21.73 16.05,21.73 v14.78,23
  Bottom 0.305: v14.91,21.05 14.83,20.97 R12.2
  Bottom 0.406: U3.6 U3.5 18.23,20.21 17.2,21.23 v17.2,21.73
  other vias: 10.59,26.3 8.56,26.3 9.57,27.32 12.62,27.32 13.64,27.32 13.64,26.3 9.57,26.3 11.61,27.32 14.65,26.3 14.65,27.32 10.59,27.32 9.57,28.34 9.57,23.38 8.56,23.26 10.59,23.38 8.56,24.27 9.57,24.27 13.76,25.16 14.78,25.16 13.76,24.14 10.59,24.27 14.78,24.14 10.59,25.29 9.57,25.29 8.56,25.29
  pour Top (no thermals): 15.03,29.99 15.03,22.24 11.61,18.81 11.61,16.14 7.29,16.14 7.29,27.45 9.83,29.99
  pour Bottom (no thermals): 9.7,29.99 14.91,29.99 15.03,29.86 15.03,22.62 7.92,22.62 7.92,28.21
VDD  (via drill 0.35)
  Bottom 0.254: U1.31 13.85,8.25 12.48,8.25 C3.1 11.51,9.22 C4.1 8.76,9.78 8.52,9.78 6.86,11.44 v6.4,11.44
  pour Top (no thermals): 2.62,19.45 0.05,15.13 8.56,0.14 25.96,0.14 34.59,14.87 32.94,18.05 31.93,17.03 31.93,15.63 31.67,15.38 27.99,15.38 27.99,13.73 26.34,12.08 26.34,5.48 25.7,4.84 14.27,4.84 14.27,4.59 13.38,3.7 9.57,3.7 7.8,5.48 7.8,10.96 6.93,11.82 4.11,11.82 4.11,19.45
VDDA  (via drill 0.35)
  Top 0.254: FB1.1 v26.65,14.49
  Top 0.305: v17.38,15.57 17.38,15.07 18.21,14.24 v20.11,14.24
  Bottom 0.254: 20.77,9.16 U1.6 U1.5 | C5.1 22.57,9.79 C1.1 21.93,9.16 20.77,9.16 | v26.65,14.49 26.58,14.55 26.52,14.55 | U1.4 20.77,9.16
  Bottom 0.305: U2.3 15.29,15.6 15.62,15.94 17.06,15.94 17.38,15.62 v17.38,15.57 18.1,16.29 C11.1 | 26.52,14.55 C2.1 C7.1 20.43,14.55 v20.11,14.24 20.11,12.59 21.64,11.06 C5.1

### Text on the board
tPlace: 18V max. | 20A max. | P5 | P1 | 3V3 | 3V3 | P4 | P2* | H0FR71 | 3V3 | P3 | 3V3
bPlace: LOAD | 20A max | PWR | 18V max | GND | P1 | P5 | GND | GND | P4 | P2* | GND | P3 | GND
tNames: B | C | D
tDocu: Note: This module should be manufactured with 2oz copper to handle 20A current.